# Altium schematic sheet pnuematic board rev0.SchDoc
size A
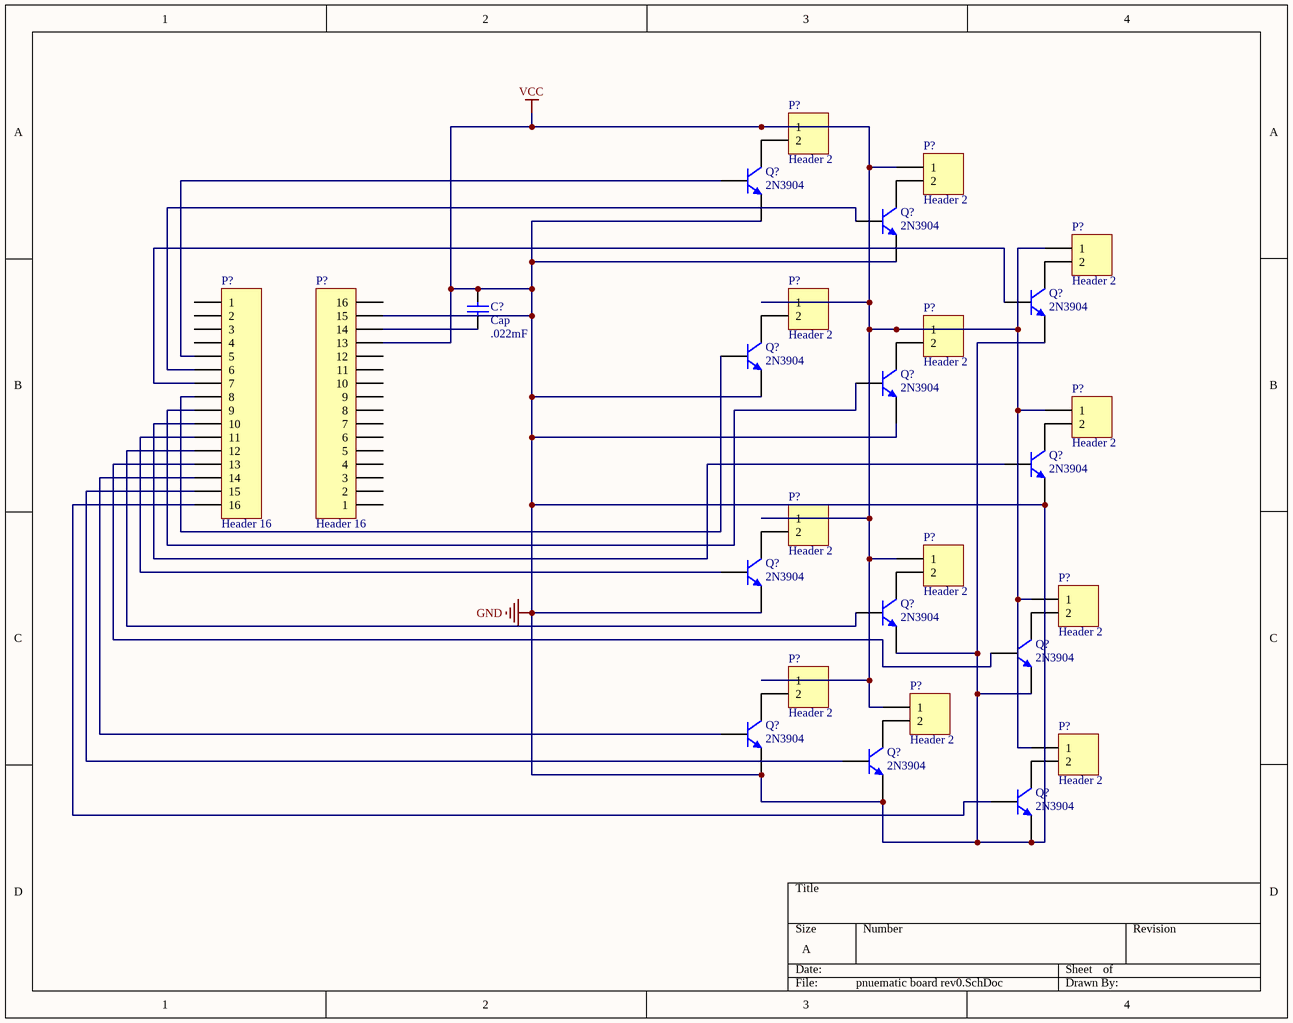
[diagram p0: pnuematic board rev0.SchDoc]

## Parts
(Parts that share a designator on the sheet are numbered #1, #2 ... from top to bottom, then left to right.)
C?  Cap  value .022mF  [RAD-0.3]
P?#1  Header 2  [HDR1X2]
P?#2  Header 2  [HDR1X2]
P?#3  Header 2  [HDR1X2]
P?#4  Header 16  [HDR1X16]
P?#5  Header 2  [HDR1X2]
P?#6  Header 2  [HDR1X2]
P?#7  Header 2  [HDR1X2]
P?#8  Header 2  [HDR1X2]
P?#9  Header 16  [HDR1X16]
P?#10  Header 2  [HDR1X2]
P?#11  Header 2  [HDR1X2]
P?#12  Header 2  [HDR1X2]
P?#13  Header 2  [HDR1X2]
P?#14  Header 2  [HDR1X2]
Q?#1  2N3904  [TO-92A]
Q?#2  2N3904  [TO-92A]
Q?#3  2N3904  [TO-92A]
Q?#4  2N3904  [TO-92A]
Q?#5  2N3904  [TO-92A]
Q?#6  2N3904  [TO-92A]
Q?#7  2N3904  [TO-92A]
Q?#8  2N3904  [TO-92A]
Q?#9  2N3904  [TO-92A]
Q?#10  2N3904  [TO-92A]
Q?#11  2N3904  [TO-92A]
Q?#12  2N3904  [TO-92A]

## Nets
GND: C?.2 P?#1.1 P?#2.1 P?#3.1 P?#5.1 P?#6.1 P?#7.1 P?#8.1 P?#9.13 P?#9.15 P?#10.1 P?#11.1 P?#12.1 P?#13.1 P?#14.1 Q?#1.1(E) Q?#2.1(E) Q?#3.1(E) Q?#4.1(E) Q?#5.1(E) Q?#6.1(E) Q?#7.1(E) Q?#8.1(E) Q?#9.1(E) Q?#10.1(E) Q?#11.1(E) Q?#12.1(E)  [also labelled VCC]
NetC?_1: C?.1 P?#9.14
NetP?#1_2: P?#1.2 Q?#1.3(C)
NetP?#2_2: P?#2.2 Q?#2.3(C)
NetP?#3_2: P?#3.2 Q?#3.3(C)
NetP?#4_5: P?#4.5 Q?#1.2(B)
NetP?#4_6: P?#4.6 Q?#2.2(B)
NetP?#4_7: P?#4.7 Q?#3.2(B)
NetP?#4_8: P?#4.8 Q?#4.2(B)
NetP?#4_9: P?#4.9 Q?#5.2(B)
NetP?#4_10: P?#4.10 Q?#6.2(B)
NetP?#4_11: P?#4.11 Q?#7.2(B)
NetP?#4_12: P?#4.12 Q?#8.2(B)
NetP?#4_13: P?#4.13 Q?#9.2(B)
NetP?#4_14: P?#4.14 Q?#10.2(B)
NetP?#4_15: P?#4.15 Q?#11.2(B)
NetP?#4_16: P?#4.16 Q?#12.2(B)
NetP?#5_2: P?#5.2 Q?#4.3(C)
NetP?#6_2: P?#6.2 Q?#5.3(C)
NetP?#7_2: P?#7.2 Q?#6.3(C)
NetP?#8_2: P?#8.2 Q?#7.3(C)
NetP?#10_2: P?#10.2 Q?#8.3(C)
NetP?#11_2: P?#11.2 Q?#9.3(C)
NetP?#12_2: P?#12.2 Q?#10.3(C)
NetP?#13_2: P?#13.2 Q?#11.3(C)
NetP?#14_2: P?#14.2 Q?#12.3(C)

Not connected (* = marked no-connect by the designer): P?#4 1 2 3 4; P?#9 1 2 3 4 5 6 7 8 9 10 11 12 16

## Library data of the parts
C? = Cap: Capacitor; Published: 8-Jun-2000; LatestRevisionDate: 17-Jul-2002; LatestRevisionNote: Re-released for DXP Platform.; PackageReference: RAD-0.3; Publisher: Altium Limited; PackageDescription: Radial Cap, Thru-Hole; 2 Leads; 0.3 in Pin Spacing
P?#1-P?#3 P?#5-P?#8 P?#10-P?#14 = Header 2: Header, 2-Pin; LatestRevisionDate: 17-Jul-2002; LatestRevisionNote: Re-released for DXP Platform.; Publisher: Altium Limited
P?#4 P?#9 = Header 16: Header, 16-Pin; LatestRevisionDate: 17-Jul-2002; LatestRevisionNote: Re-released for DXP Platform.; Publisher: Altium Limited
Q?#1-Q?#12 = 2N3904: NPN General Purpose Amplifier; Published: 8-Jun-2000; LatestRevisionDate: 15-Jan-2003; LatestRevisionNote: PCB Footprint 'BCY-W3/D4.7' replaced; DatasheetVersion: 1997; PackageVersion: Sep-1998; PackageReference: TO-92A; Publisher: Altium Limited; PackageDescription: TO, Flat Index; 3 In-Line, Axial Leads; Body Dia. 4.5mm; Leads 0.51 x 0.48 mm (max); ComponentLink1Description: Manufacturer Link; ComponentLink1URL: http://www.fairchildsemi.com/; ComponentLink2Description: Datasheet; ComponentLink2URL: http://www.fairchildsemi.com/ds/2N%2F2N3904.pdf